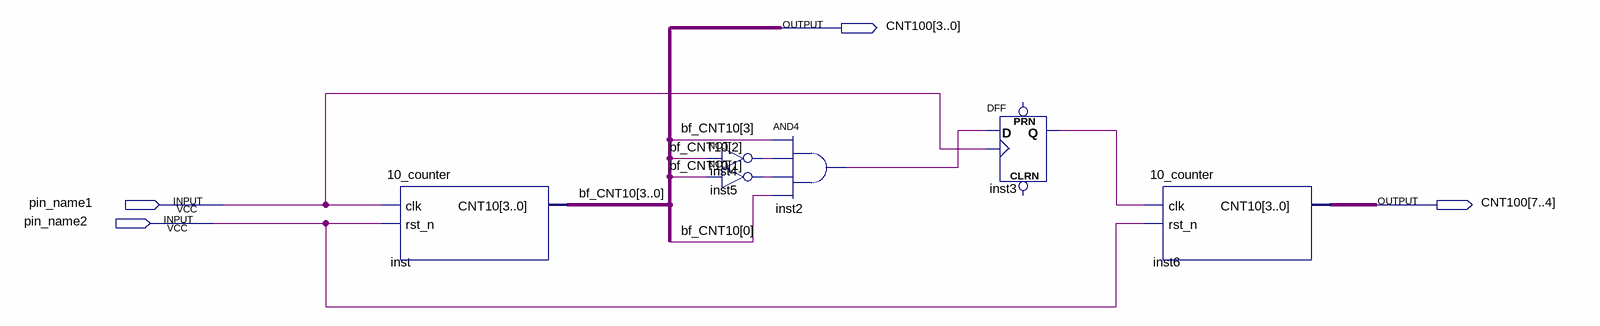
[diagram p0: schematic sheet]
// Quartus schematic chap5.bdf as structural Verilog: 6 symbols, 4 pins
module chap5 (
  input  pin_name1,
  input  pin_name2,
  output [7:0] CNT100
);

  wire inst2_out, inst3_q, inst4_out, inst5_out;

  \10_counter  inst (.clk(pin_name1), .rst_n(pin_name2), .CNT10(CNT100[3:0]));
  not inst4 (inst4_out, CNT100[2]);
  not inst5 (inst5_out, CNT100[1]);
  and inst2 (inst2_out, CNT100[3], inst4_out, inst5_out, CNT100[0]);
  DFF inst3 (.CLK(pin_name1), .D(inst2_out), .Q(inst3_q));  // open: CLRN, PRN
  \10_counter  inst6 (.clk(inst3_q), .rst_n(pin_name2), .CNT10(CNT100[7:4]));

  // Other names for the same wires on the sheet: bf_CNT10[3:0] = CNT100[3:0]
endmodule
